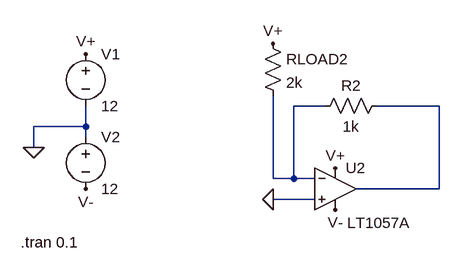
[diagram p0: schematic trans_impedance.asc]
trans_impedance.asc, the LTspice schematic file:
Version 4
SHEET 1 1052 680
WIRE 272 128 224 128
WIRE 448 128 352 128
WIRE -96 160 -96 128
WIRE -96 160 -176 160
WIRE -96 176 -96 160
WIRE -176 192 -176 160
WIRE 192 240 192 112
WIRE 224 240 224 128
WIRE 224 240 192 240
WIRE 256 240 224 240
WIRE 448 256 448 128
WIRE 448 256 320 256
WIRE 256 272 192 272
FLAG -96 48 V+
FLAG -96 256 V-
FLAG -176 192 0
FLAG 288 288 V-
FLAG 288 224 V+
FLAG 192 32 V+
FLAG 192 272 0
SYMBOL Opamps\\LT1057A 288 192 R0
WINDOW 3 18 116 Left 2
SYMATTR InstName U2
SYMBOL voltage -96 32 R0
WINDOW 123 0 0 Left 0
WINDOW 39 0 0 Left 0
SYMATTR InstName V1
SYMATTR Value 12
SYMBOL voltage -96 160 R0
WINDOW 123 0 0 Left 0
WINDOW 39 0 0 Left 0
SYMATTR InstName V2
SYMATTR Value 12
SYMBOL res 176 16 R0
SYMATTR InstName RLOAD2
SYMATTR Value 2k
SYMBOL res 368 112 R90
WINDOW 0 0 56 VBottom 2
WINDOW 3 32 56 VTop 2
SYMATTR InstName R2
SYMATTR Value 1k
TEXT -196 338 Left 2 !.tran 0.1

The netlist it stands for:
* trans_impedance.asc
XU2 0 N001 V+ V- N002 LT1057A  ; pins In+ In- V+ V- OUT
V1 V+ 0 12
V2 0 V- 12
RLOAD2 V+ N001 2k
R2 N002 N001 1k
.tran 0.1
.backanno
.end